# Altium schematic sheet Isolated Communication.SchDoc
size A3; SheetNumber: 5; SheetTotal: 12
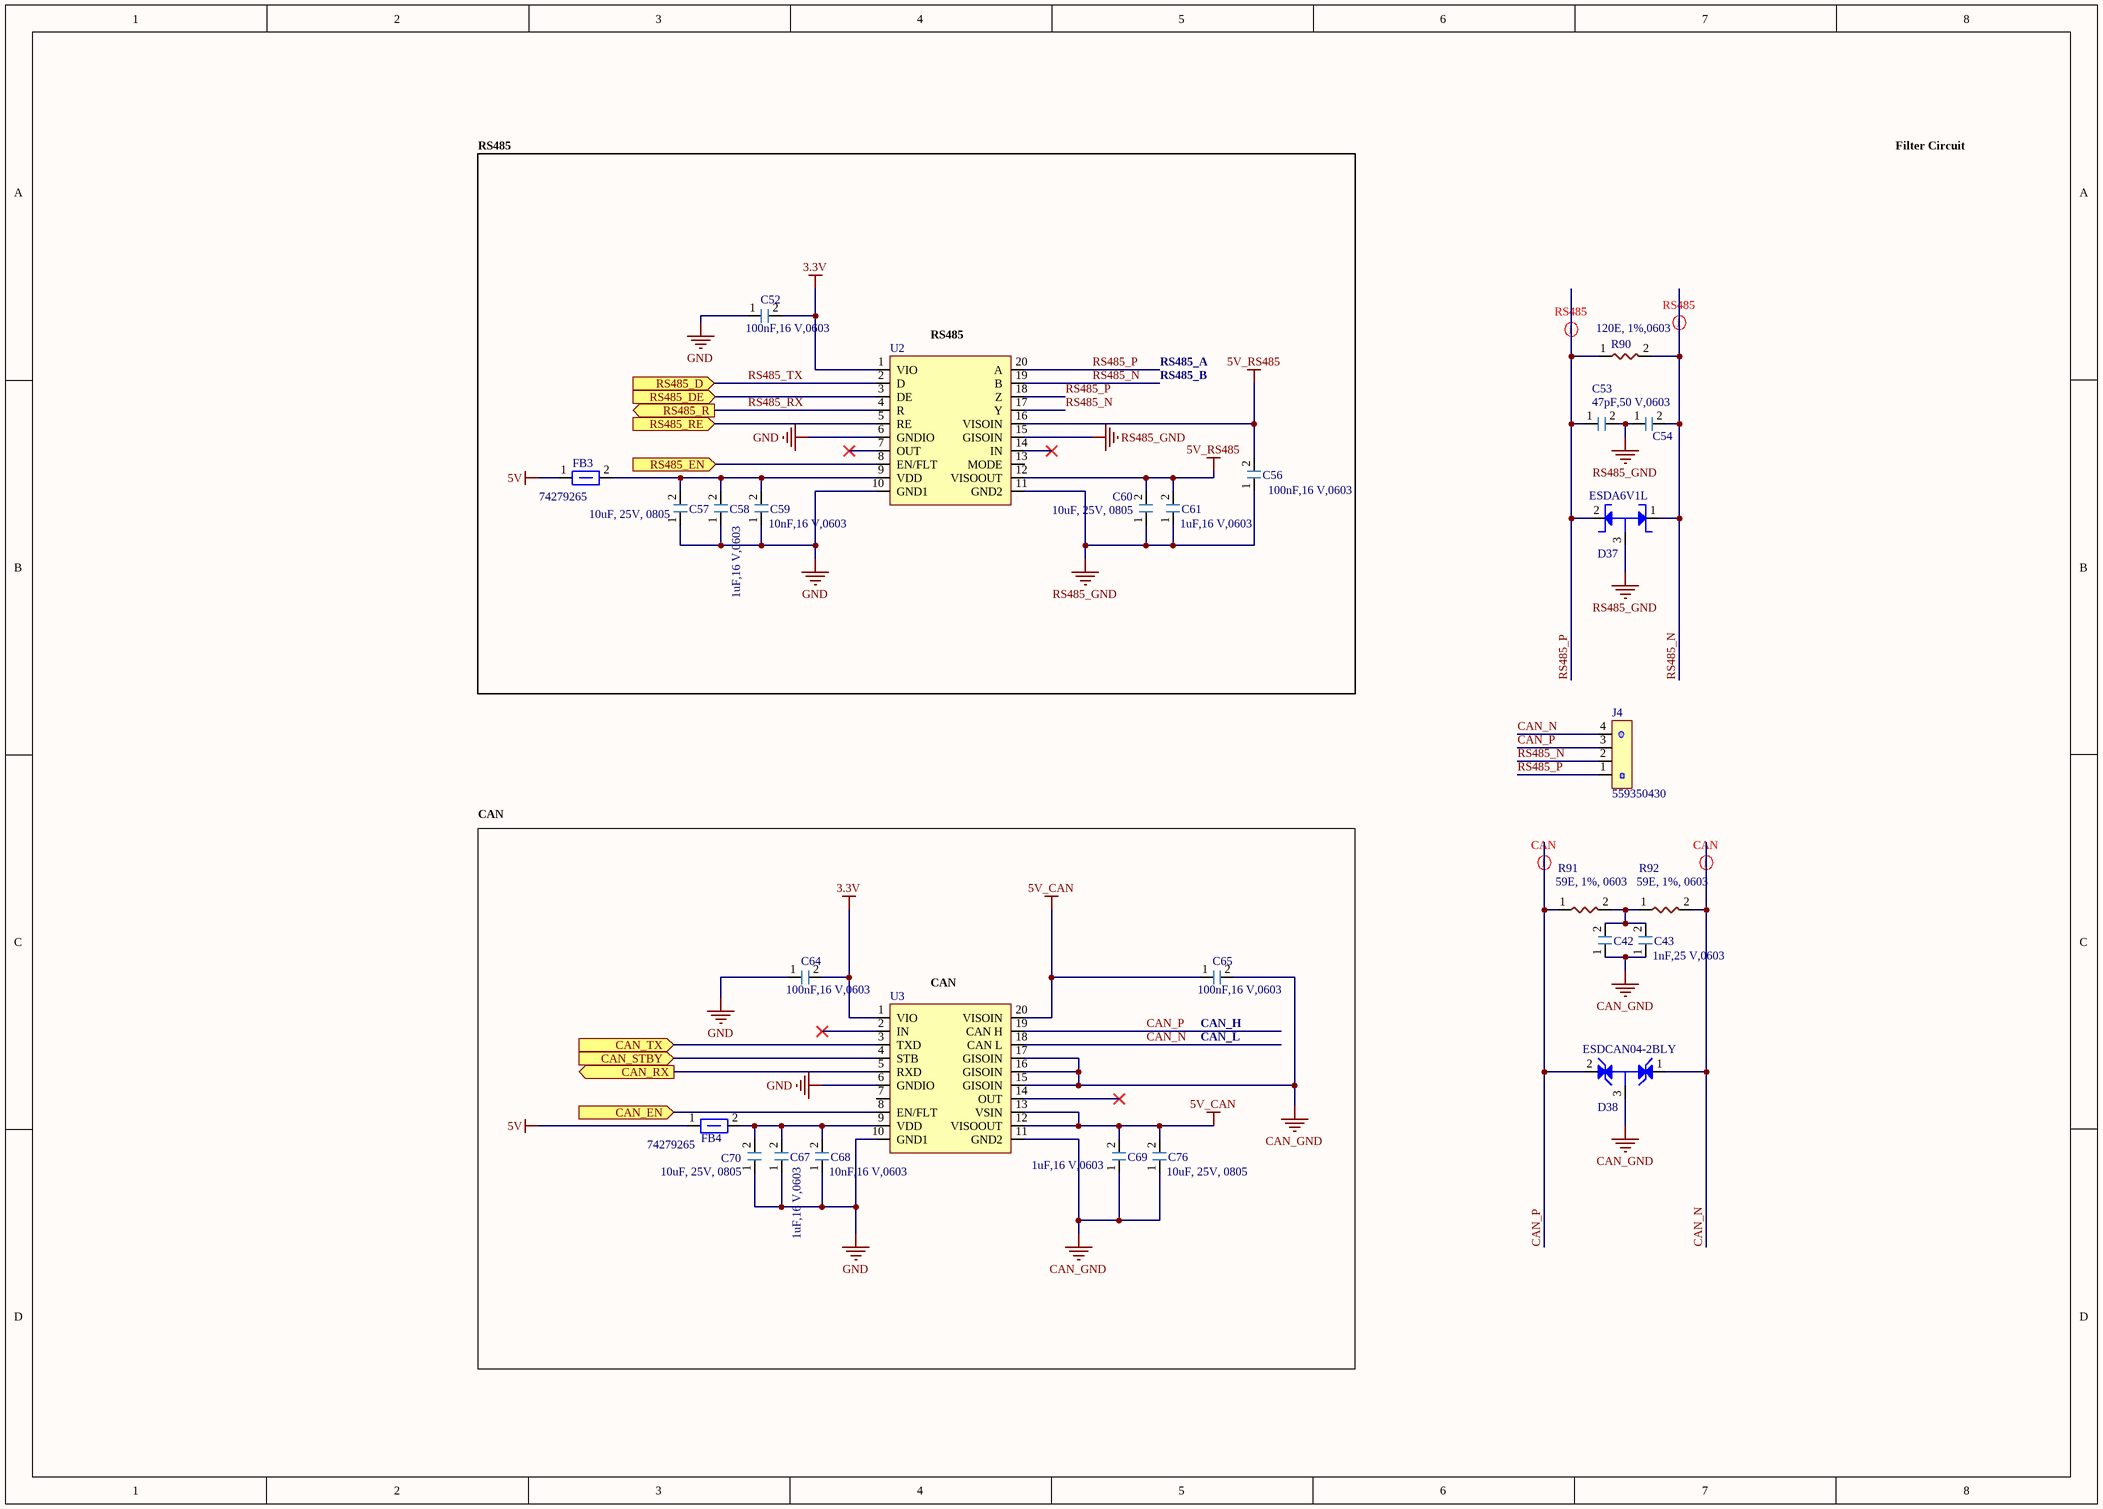
[diagram p0: Isolated Communication.SchDoc]

## Parts
C42  C0603C102J3GACAUTO  [CAPC1608X05N 0603]  (value not drawn)
C43  Value Display: 1nF,25 V,0603  [CAPC1608X05N 0603]  (hidden comment: C0603C102J3GACAUTO)
C52  Value Display: 100nF,16 V,0603  [CAPC1608X05N 0603]  (hidden comment: CC0603KRX7R7BB104)
C53  Value Display: 47pF,50 V,0603  [CAPC1608X05N 0603]  (hidden comment: CC0603JRNPO9BN470)
C54  CC0603JRNPO9BN470  [CAPC1608X05N 0603]  (value not drawn)
C56  Value Display: 100nF,16 V,0603  [CAPC1608X05N 0603]  (hidden comment: CC0603KRX7R7BB104)
C57  Value Display: 10uF, 25V, 0805  [CAPC2012X13N 0805]  (hidden comment: GRM21BZ71E106KE15L)
C58  Value Display: 1uF,16 V,0603  [CAPC1608X05N 0603]  (hidden comment: CGA3E1X7R1C105K080AC)
C59  Value Display: 10nF,16 V,0603  [CAPC1608X05N 0603]  (hidden comment: C0603C103K4RECTU)
C60  Value Display: 10uF, 25V, 0805  [CAPC2012X13N 0805]  (hidden comment: GRM21BZ71E106KE15L)
C61  Value Display: 1uF,16 V,0603  [CAPC1608X05N 0603]  (hidden comment: CGA3E1X7R1C105K080AC)
C64  Value Display: 100nF,16 V,0603  [CAPC1608X05N 0603]  (hidden comment: CC0603KRX7R7BB104)
C65  Value Display: 100nF,16 V,0603  [CAPC1608X05N 0603]  (hidden comment: CC0603KRX7R7BB104)
C67  Value Display: 1uF,16 V,0603  [CAPC1608X05N 0603]  (hidden comment: CGA3E1X7R1C105K080AC)
C68  Value Display: 10nF,16 V,0603  [CAPC1608X05N 0603]  (hidden comment: C0603C103K4RECTU)
C69  Value Display: 1uF,16 V,0603  [CAPC1608X05N 0603]  (hidden comment: CGA3E1X7R1C105K080AC)
C70  Value Display: 10uF, 25V, 0805  [CAPC2012X13N 0805]  (hidden comment: GRM21BZ71E106KE15L)
C76  Value Display: 10uF, 25V, 0805  [CAPC2012X13N 0805]  (hidden comment: GRM21BZ71E106KE15L)
D37  ESDA6V1L  [SOT95P255X140-3N]
D38  ESDCAN04-2BLY  [SOT95P255X125-3N]
FB3  74279265  [RESC1608X05N 0603]
FB4  74279265  [RESC1608X05N 0603]
J4  559350430  [Con_559350430]
R90  Value Display: 120E, 1%,0603  [RESC1608X05N 0603]  (hidden comment: AF0603FR-07120RL)
R91  Value Display: 59E, 1%, 0603  [RESC1608X05N 0603]  (hidden comment: AC0603FR-0759RL)
R92  Value Display: 59E, 1%, 0603  [RESC1608X05N 0603]  (hidden comment: AC0603FR-0759RL)
U2  ISOW1412BDFMR  [SOIC127P1030X355-20N]  (value not drawn)
U3  ISOW1044BDFMR  [SOIC127P1030X355-20N]  (value not drawn)

## Ports
CAN_EN (in), CAN_RX (out), CAN_STBY (in), CAN_TX (in), RS485_D (in), RS485_DE (in), RS485_EN (in), RS485_R (out), RS485_RE (in)

## Nets
3.3V: C52.2 C64.2 U2.1(VIO) U3.1(VIO)
5V: FB3.1 FB4.1
5V_CAN: C65.1 C69.2 C76.2 U3.12(VISOOUT) U3.13(VSIN) U3.20(VISOIN)
5V_RS485: C56.2 C60.2 C61.2 U2.12(VISOOUT) U2.16(VISOIN)
CAN_GND: C42.1 C43.1 C65.2 C69.1 C76.1 D38.3 U3.11(GND2) U3.15(GISOIN) U3.16(GISOIN) U3.17(GISOIN)
GND: C52.1 C57.1 C58.1 C59.1 C64.1 C67.1 C68.1 C70.1 U2.6(GNDIO) U2.10(GND1) U3.6(GNDIO) U3.10(GND1)
RS485_GND: C53.2 C54.1 C56.1 C60.1 C61.1 D37.3(Anode) U2.11(GND2) U2.15(GISOIN)
CAN_EN: U3.8(EN/FLT) ; port CAN_EN
CAN_N: D38.1(Cathode) J4.4 R92.2 U3.18(CAN_L)
CAN_P: D38.2(Anode) J4.3 R91.1 U3.19(CAN_H)
CAN_RX: U3.5(RXD) ; port CAN_RX
CAN_STBY: U3.4(STB) ; port CAN_STBY
CAN_TX: U3.3(TXD) ; port CAN_TX
RS485_DE: U2.3(DE) ; port RS485_DE
RS485_EN: U2.8(EN/FLT) ; port RS485_EN
RS485_N: C54.2 D37.1(Cathode) J4.2 R90.2 U2.17(Y) U2.19(B)
RS485_P: C53.1 D37.2(Cathode) J4.1 R90.1 U2.18(Z) U2.20(A)
RS485_RE: U2.5(RE) ; port RS485_RE
RS485_RX: U2.4(R) ; port RS485_R
RS485_TX: U2.2(D) ; port RS485_D
NetC42_2: C42.2 C43.2 R91.2 R92.1
NetC57_2: C57.2 C58.2 C59.2 FB3.2 U2.9(VDD)
NetC67_2: C67.2 C68.2 C70.2 FB4.2 U3.9(VDD)

Not connected (* = marked no-connect by the designer): U2 7(OUT)* 13(MODE) 14(IN)*; U3 2(IN)* 7 14(OUT)*

## Layout directives
differential pair: CAN_N, CAN_P, RS485_N, RS485_P

## Notes on the sheet
- RS485
- Filter Circuit
- (near U2) RS485
- RS485_A
- RS485_B
- CAN
- (near U3) CAN
- (near C65) CAN_H
- CAN_L

## Library data of the parts
C42 = Cap_C0603C102J3GACAUTO: Multilayer Ceramic Capacitor, 1000 pF, 25V, ±5%,  C0G 0603 [1608 Metric]; Manufacturer: KEMET; Value: 1nF; Max Temp: 125 degC; Min Temp: -55 degC; Polarized: No; Temp Coefficient: C0G, NP0; Value Display: 1nF,25 V,0603; AEC-Q: 200; Manufacturer Part Number: C0603C102J3GACAUTO; Voltage: 25V; Category: Capacitor; ComponentLink1Description: Datasheet; Mount Type: Surface Mount; Package: 0603; RoHS: Yes; Supplier 1: Digikey; Supplier 1 Part Number: 399-C0603C102J3GACAUTOCT-ND; Supplier 1 pricing per Unit: 9.17 INR; Supplier: Mouser; Supplier Part Number: 80-C0603C102J3GAUTO; Supplier pricing per Unit: 8.34 INR; Technology: Ceramic; Tolerance: 5%; Value 1: C0603C102J3GACAUTO; ComponentLink1URL: https://connect.kemet.com:7667/gateway/IntelliData-ComponentDocumentation/1.0/download/datasheet/C0603C102J3GACAUTO
C43 = Cap_C0603C102J3GACAUTO: Multilayer Ceramic Capacitor, 1000 pF, 25V, ±5%,  C0G 0603 [1608 Metric]; Manufacturer: KEMET; Value: 1nF; Max Temp: 125 degC; Min Temp: -55 degC; Polarized: No; Temp Coefficient: C0G, NP0; AEC-Q: 200; Manufacturer Part Number: C0603C102J3GACAUTO; Voltage: 25V; Category: Capacitor; ComponentLink1Description: Datasheet; Mount Type: Surface Mount; Package: 0603; RoHS: Yes; Supplier 1: Digikey; Supplier 1 Part Number: 399-C0603C102J3GACAUTOCT-ND; Supplier 1 pricing per Unit: 9.17 INR; Supplier: Mouser; Supplier Part Number: 80-C0603C102J3GAUTO; Supplier pricing per Unit: 8.34 INR; Technology: Ceramic; Tolerance: 5%; Value 1: C0603C102J3GACAUTO; ComponentLink1URL: https://connect.kemet.com:7667/gateway/IntelliData-ComponentDocumentation/1.0/download/datasheet/C0603C102J3GACAUTO
C52 C56 C64 C65 = Cap_CC0603KRX7R7BB104: Multilayer Ceramic Capacitor, 100 nF, 16V, ±10%,  X7R 0603 [1608 Metric]; Manufacturer: Yageo; Value: 100nF; Max Temp: 125 degC; Min Temp: -55 degC; Polarized: No; AEC-Q: NA; Manufacturer Part Number: CC0603KRX7R7BB104; Category: Capacitor; ComponentLink1Description: Datasheet; Mount Type: Surface Mount; Package: 0603; RoHS: Yes; Supplier 1: Digikey; Supplier 1 Part Number: 311-1088-1-ND; Supplier 1 pricing per Unit: 8.34 INR; Supplier: Mouser; Supplier Part Number: 603-CC603KRX7R7BB104; Supplier pricing per Unit: 8.34 INR; Technology: Ceramic; Temp Coefficient: X7R; Tolerance: 10%; Value 1: CC0603KRX7R7BB104; Voltage: 16V; ComponentLink1URL: https://www.yageo.com/upload/media/product/productsearch/datasheet/mlcc/UPY-GPHC_X7R_6.3V-to-250V_24.pdf
C53 = Cap_CC0603JRNPO9BN470: Multilayer Ceramic Capacitor, 47 pF, 50V, ±5%,  C0G 0603 [1608 Metric]; Manufacturer: Yageo; AEC-Q: NA; Max Temp: 125 degC; Min Temp: -55 degC; Polarized: No; Temp Coefficient: C0G, NP0; Value: 47pF; Manufacturer Part Number: CC0603JRNPO9BN470; Category: Capacitor; ComponentLink1Description: Datasheet; ComponentLink1URL: https://www.yageo.com/upload/media/product/productsearch/datasheet/mlcc/UPY-GP_NP0_16V-to-50V_18.pdf; Mount Type: Surface Mount; Package: 0603; RoHS: Yes; Supplier 1: Digikey; Supplier 1 Part Number: 311-1065-1-ND; Supplier 1 pricing per Unit: 8.34 INR; Supplier: Mouser; Supplier Part Number: 603-CC603JRNPO9BN470; Supplier pricing per Unit: 8.34 INR; Technology: Ceramic; Tolerance: 5%; Value 1: CC0603JRNPO9BN470; Voltage: 50V
C54 = Cap_CC0603JRNPO9BN470: Multilayer Ceramic Capacitor, 47 pF, 50V, ±5%,  C0G 0603 [1608 Metric]; Manufacturer: Yageo; AEC-Q: NA; Max Temp: 125 degC; Min Temp: -55 degC; Polarized: No; Temp Coefficient: C0G, NP0; Value: 47pF; Value Display: 47pF,50 V,0603; Manufacturer Part Number: CC0603JRNPO9BN470; Category: Capacitor; ComponentLink1Description: Datasheet; ComponentLink1URL: https://www.yageo.com/upload/media/product/productsearch/datasheet/mlcc/UPY-GP_NP0_16V-to-50V_18.pdf; Mount Type: Surface Mount; Package: 0603; RoHS: Yes; Supplier 1: Digikey; Supplier 1 Part Number: 311-1065-1-ND; Supplier 1 pricing per Unit: 8.34 INR; Supplier: Mouser; Supplier Part Number: 603-CC603JRNPO9BN470; Supplier pricing per Unit: 8.34 INR; Technology: Ceramic; Tolerance: 5%; Value 1: CC0603JRNPO9BN470; Voltage: 50V
C57 C60 C70 C76 = Cap_GRM21BZ71E106KE15L: Multilayer Ceramic Capacitor, 10 uF, 25V, ±10%,  X7R 0805 (2012 Metric); Manufacturer: Murata; AEC-Q: NA; Max Temp: 125 degC; Min Temp: -55 degC; Polarized: No; Value: 10 uF; Category: Capacitor; ComponentLink1Description: Datasheet; ComponentLink1URL: https://search.murata.co.jp/Ceramy/image/img/A01X/G101/ENG/GRM21BZ71E106KE15-01.pdf; Manufacturer Part Number: GRM21BZ71E106KE15L; Mount Type: Surface Mount; Package: 0805; RoHS: Yes; Supplier 1: Digikey; Supplier 1 Part Number: 490-GRM21BZ71E106KE15LCT-ND; Supplier 1 pricing per Unit: 28.51 INR; Supplier: Mouser; Supplier Part Number: 81-GRM21BZ71E106KE5L; Supplier pricing per Unit: 30.02 INR; Technology: Ceramic; Temp Coefficient: X7R; Tolerance: 10%; Value 1: GRM21BZ71E106KE15L; Voltage: 25V
C58 C61 C67 C69 = Cap_CGA3E1X7R1C105K080AC: Multilayer Ceramic Capacitor, 1uF, 16V, ±10%,  X7R 0603 [1608 Metric]; Manufacturer: TDK Corporation; Polarized: No; AEC-Q: 200; Min Temp: -55 degC; Max Temp: 125 degC; Value: 1 uF; Manufacturer Part Number: CGA3E1X7R1C105K080AC; Package: 0603; RoHS: Yes; Mount Type: Surface Mount; Supplier 1: Digikey; Voltage: 16V; Tolerance: 10%; Technology: Ceramic; Value 1: CGA3E1X7R1C105K080AC; Category: Capacitor; ComponentLink1Description: Datasheet; ComponentLink1URL: https://product.tdk.com/system/files/dam/doc/product/capacitor/ceramic/mlcc/catalog/mlcc_automotive_general_en.pdf; Supplier 1 Part Number: 445-12539-1-ND; Supplier 1 pricing per Unit: 10.84 INR; Supplier: Mouser; Supplier Part Number: 810-CGA3E1X7R1C105AC; Supplier pricing per Unit: 10.01 INR; Temp Coefficient: X7R
C59 C68 = Cap_C0603C103K4RECTU: Multilayer Ceramic Capacitor, 10 nF, 16V, ±10%,  X7R 0603 [1608 Metric]; Manufacturer: KEMET; AEC-Q: NA; Max Temp: 125 degC; Min Temp: -55 degC; Polarized: No; Value: 10 nF; Category: Capacitor; ComponentLink1Description: Datasheet; ComponentLink1URL: https://content.kemet.com/datasheets/KEM_C1090_X7R_ESD.pdf; Manufacturer Part Number: C0603C103K4RECTU; Mount Type: Surface Mount; Package: 0603; RoHS: Yes; Supplier 1: Digikey; Supplier 1 Part Number: 399-C0603C103K4REC7867CT-ND; Supplier 1 pricing per Unit: 9.21 INR; Supplier: Mouser; Supplier Part Number: 80-C0603C103K4RECTU; Supplier pricing per Unit: 8.34 INR; Technology: Ceramic; Temp Coefficient: X7R; Tolerance: 10%; Value 1: C0603C103K4RECTU; Voltage: 16V
D37 = Diode_TVS_ESDA6V1L: Clamp Ipp Tvs Diode Surface Mount SOT-23-3 Unidirectional; Manufacturer: ST; AEC-Q: NA; Max Temp: 125 degC; Min Temp: -40 degC; Power: 300W; Voltage: 6.1V; Category: TVS Diode; ComponentLink1Description: Datasheet; ComponentLink1URL: https://www.st.com/content/ccc/resource/technical/document/datasheet/eb/9f/a7/ac/7b/b6/46/7f/CD00002057.pdf/files/CD00002057.pdf/jcr:content/translations/en.CD00002057.pdf; Manufacturer Part Number: ESDA6V1L; Mount Type: Surface Mount; Package: SOT 23-3; RoHS: Yes; Supplier 1: Digikey; Supplier 1 Part Number: 497-2930-1-ND; Supplier 1 pricing per Unit: 31.71 INR; Supplier: Mouser; Supplier Part Number: 511-ESDA6V1L; Supplier pricing per Unit: 33.36 INR; Value 1: ESDA6V1L; VALUE: ESDA6V1L; Value Display: ESDA6V1L
D38 = Diode_TVS_ESDCAN04-2BLY: 43V Clamp 3.7A (8/20µs) Ipp Tvs Diode Surface Mount SOT-23-3 Bidirectional; Manufacturer: ST; AEC-Q: 101; Max Temp: 150 degC; Min Temp: -40 degC; Power: 230W; Category: TVS Diode; ComponentLink1Description: Datasheet; ComponentLink1URL: https://www.st.com/resource/en/datasheet/esdcan01-2bly.pdf; Manufacturer Part Number: ESDCAN04-2BLY; Mount Type: Surface Mount; Package: SOT 23-3; RoHS: Yes; Supplier 1: Digikey; Supplier 1 Part Number: 497-19089-1-ND; Supplier 1 pricing per Unit: 35.05 INR; Supplier: Mouser; Supplier Part Number: 511-ESDCAN04-2BLY; Supplier pricing per Unit: 34.19 INR; Value 1: ESDCAN04-2BLY; VALUE: ESDCAN04-2BLY; Value Display: ESDCAN04-2BLY; Voltage: 43V
FB3 FB4 = FB_74279265: 600 Ohms @ 100 MHz 1 Signal Line Ferrite Bead 0603 (1608 Metric) 200mA 450mOhm; Manufacturer: Wurth Electronik; AEC-Q: 200; Max Temp: 125 degC; Min Temp: -55 degC; Value 1: 600 Ohms @100MHHz; Category: Ferrite Bead; ComponentLink1Description: Datasheet; ComponentLink1URL: https://www.we-online.com/components/products/datasheet/74279265.pdf; Manufacturer Part Number: 74279265; Mount Type: Surface Mount; Package: 0603; RoHS: Yes; Supplier 1: Digikey; Supplier 1 Part Number: 732-1583-1-ND; Supplier 1 pricing per Unit: 15.07 INR; Supplier: Mouser; Supplier Part Number: 710-74279265; Supplier pricing per Unit: 14.10 INR; Value: 74279265; Value Display: 600 Ohms
J4 = Con_559350430: 2.00mm Pitch MicroClasp Wire-to-Board Header, Dual Row, Right Angle, 4 Circuits; Crimp Part Number: 561349000; Manufacturer: Molex; Manufacturer Part Number: 0559350430; Mating Part Number: 513820400; Circuits: 4; AEC-Q: NA; Rows: 1; Value: 4 Pin; Value Display: 4 Pin/RA/TH; Category: Connector; Colour: Natural; ComponentLink1Description: Datasheet; Pitch: 2.00 mm; ComponentLink1URL: https://www.molex.com/en-us/products/part-detail-pdf/559350430?display=pdf; Mount Type: TH; Package: THT; RoHS: Yes; Supplier 1: Digikey; Supplier 1 Part Number: WM12300-ND; Supplier 1 pricing per Unit: 36.05 INR; Supplier: Mouser; Supplier Part Number: 538-55935-0430; Supplier pricing per Unit: 28.36 INR; Value 1: 559350430
R90 = Res_AF0603FR-07120RL: SMD Chip Resistor,120 Ohms ±1%, 1/10W, 0603 (1608 Metric) Anti-Sulfur, Automotive AEC-Q200 Thick Film; Manufacturer: Yageo; AEC-Q: 200; Max Temp: 155 degC; Min Temp: -55 degC; Value: 120R; Category: Resistor; ComponentLink1Description: Datasheet; ComponentLink1URL: https://www.yageo.com/upload/media/product/app/datasheet/rchip/pyu-af_51_rohs_l.pdf; Manufacturer Part Number: AF0603FR-07120RL; Mount Type: Surface Mount; Package: 0603; Power: 1/10W; RoHS: Yes; Supplier 1: Digikey; Supplier 1 Part Number: 13-AF0603FR-07120RLCT-ND; Supplier 1 pricing per Unit: 8.34 INR; Supplier: Mouser; Supplier Part Number: 603-AF0603FR-07120RL; Supplier pricing per Unit: 8.34 INR; Tolerance: 1%; Value 1: AF0603FR-07120RL
R91 R92 = Res_AC0603FR-0759RL: SMD Chip Resistor,59 Ohms ±1% 0.1W, 1/10W, 0603 (1608 Metric) Anti-Sulfur, Automotive AEC-Q200 Thick Film; Manufacturer: Yageo; AEC-Q: 200; Max Temp: 155 degC; Min Temp: -55 degC; Value: 59R; Category: Resistor; ComponentLink1Description: Datasheet; ComponentLink1URL: https://www.yageo.com/upload/media/product/productsearch/datasheet/rchip/PYu-AC_51_RoHS_L_10.pdf; Manufacturer Part Number: AC0603FR-0759RL; Mount Type: Surface Mount; Package: 0603; Power: 1/10W; RoHS: Yes; Supplier 1: Digikey; Supplier 1 Part Number: 13-AC0603FR-0759RLCT-ND; Supplier 1 pricing per Unit: 8.34 INR; Supplier: Mouser; Supplier Part Number: 603-AC0603FR-0759RL; Supplier pricing per Unit: 8.34 INR; Tolerance: 1%; Value 1: AC0603FR-0759RL
U2 = IC_ISOW1412BDFMR: RS-422/RS-485 Interface IC EMC protected, 500-Kbps, full-duplex, 5-kVrms isolated RS-485 & RS-422 transceiver 16-SOIC -40 to 125; Manufacturer: Texas Instruments; AEC-Q: NA; Max Temp: 125 degC; Min Temp: -40 degC; Manufacturer Part Number: ISOW1412BDFMR; Category: Isolated RS485; ComponentLink1Description: Datasheet; ComponentLink1URL: https://www.ti.com/lit/ds/symlink/isow1432.pdf?ts=1718250901222&ref_url=https%253A%252F%252Fwww.mouser.in%252F; Mount Type: Surface Mount; Package: DFM; RoHS: Yes; Supplier 1: Digikey; Supplier 1 Part Number: 296-ISOW1412BDFMRCT-ND; Supplier 1 pricing per Unit: 742.42 INR; Supplier: Mouser; Supplier Part Number: 595-ISOW1412BDFMR; Supplier pricing per Unit: 885.71 INR; Value 1: ISOW1412BDFMR; Value: ISOW1412BDFMR; Value Display: ISOW1412BDFMR
U3 = IC_ISOW1044BDFMR: 1/1 Transceiver, Isolated Half CANbus 20-SOIC; Manufacturer: Texas Instruments; AEC-Q: NA; Max Temp: 125 degC; Min Temp: -40 degC; Manufacturer Part Number: ISOW1044BDFMR; Category: Isolated CAN; ComponentLink1Description: Datasheet; ComponentLink1URL: https://www.ti.com/lit/ds/symlink/isow1044.pdf?ts=1694787726249&ref_url=https%253A%252F%252Fwww.ti.com%252Fsitesearch%252Fen-us%252Fdocs%252Funiversalsearch.tsp%253FlangPref%253Den-US%2526searchTerm%253DISOW1044BDFMR%2526nr%253D6; Mount Type: Surface Mount; Package: DFM; RoHS: Yes; Supplier 1: Digikey; Supplier 1 Part Number: 296-ISOW1044BDFMRCT-ND; Supplier 1 pricing per Unit: 736.25 INR; Supplier: Mouser; Supplier Part Number: 595-ISOW1044BDFMR; Supplier pricing per Unit: 881.54 INR; Value 1: ISOW1044BDFMR; Value: ISOW1044BDFMR; Value Display: ISOW1044BDFMR